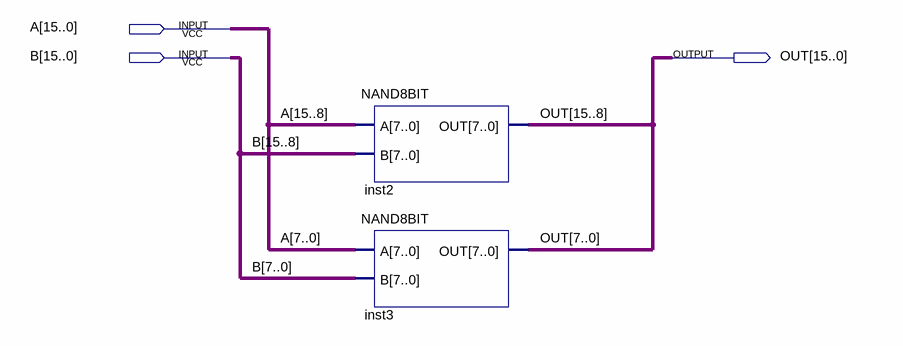
[diagram p0: schematic sheet]
// Quartus schematic NAND16BIT.bdf as structural Verilog: 2 symbols, 3 pins
module NAND16BIT (
  input  [15:0] A,
  input  [15:0] B,
  output [15:0] OUT
);

  NAND8BIT inst2 (.A(A[15:8]), .B(B[15:8]), .OUT(OUT[15:8]));
  NAND8BIT inst3 (.A(A[7:0]), .B(B[7:0]), .OUT(OUT[7:0]));
endmodule
